# EAGLE design 40Ortho (EAGLE 9.6.2)
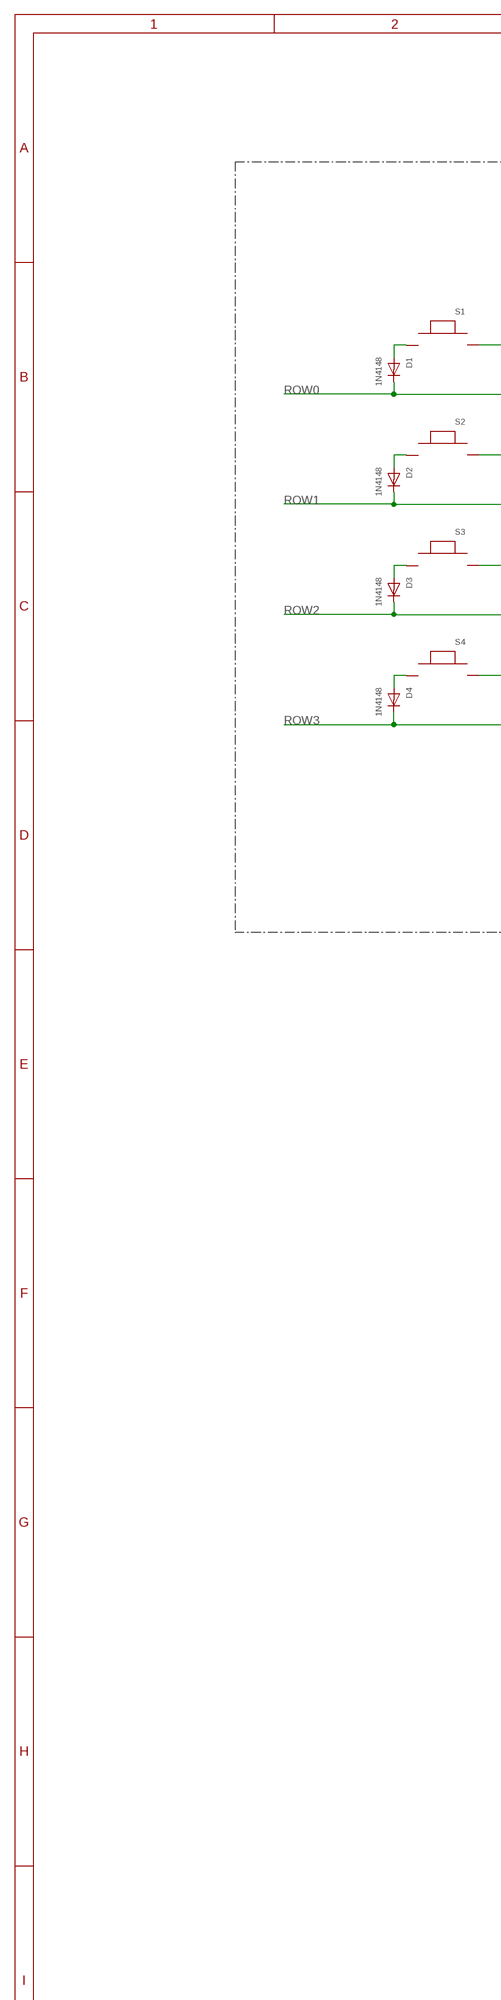
[diagram p0: schematic, sheet 1, part 1 of 2]
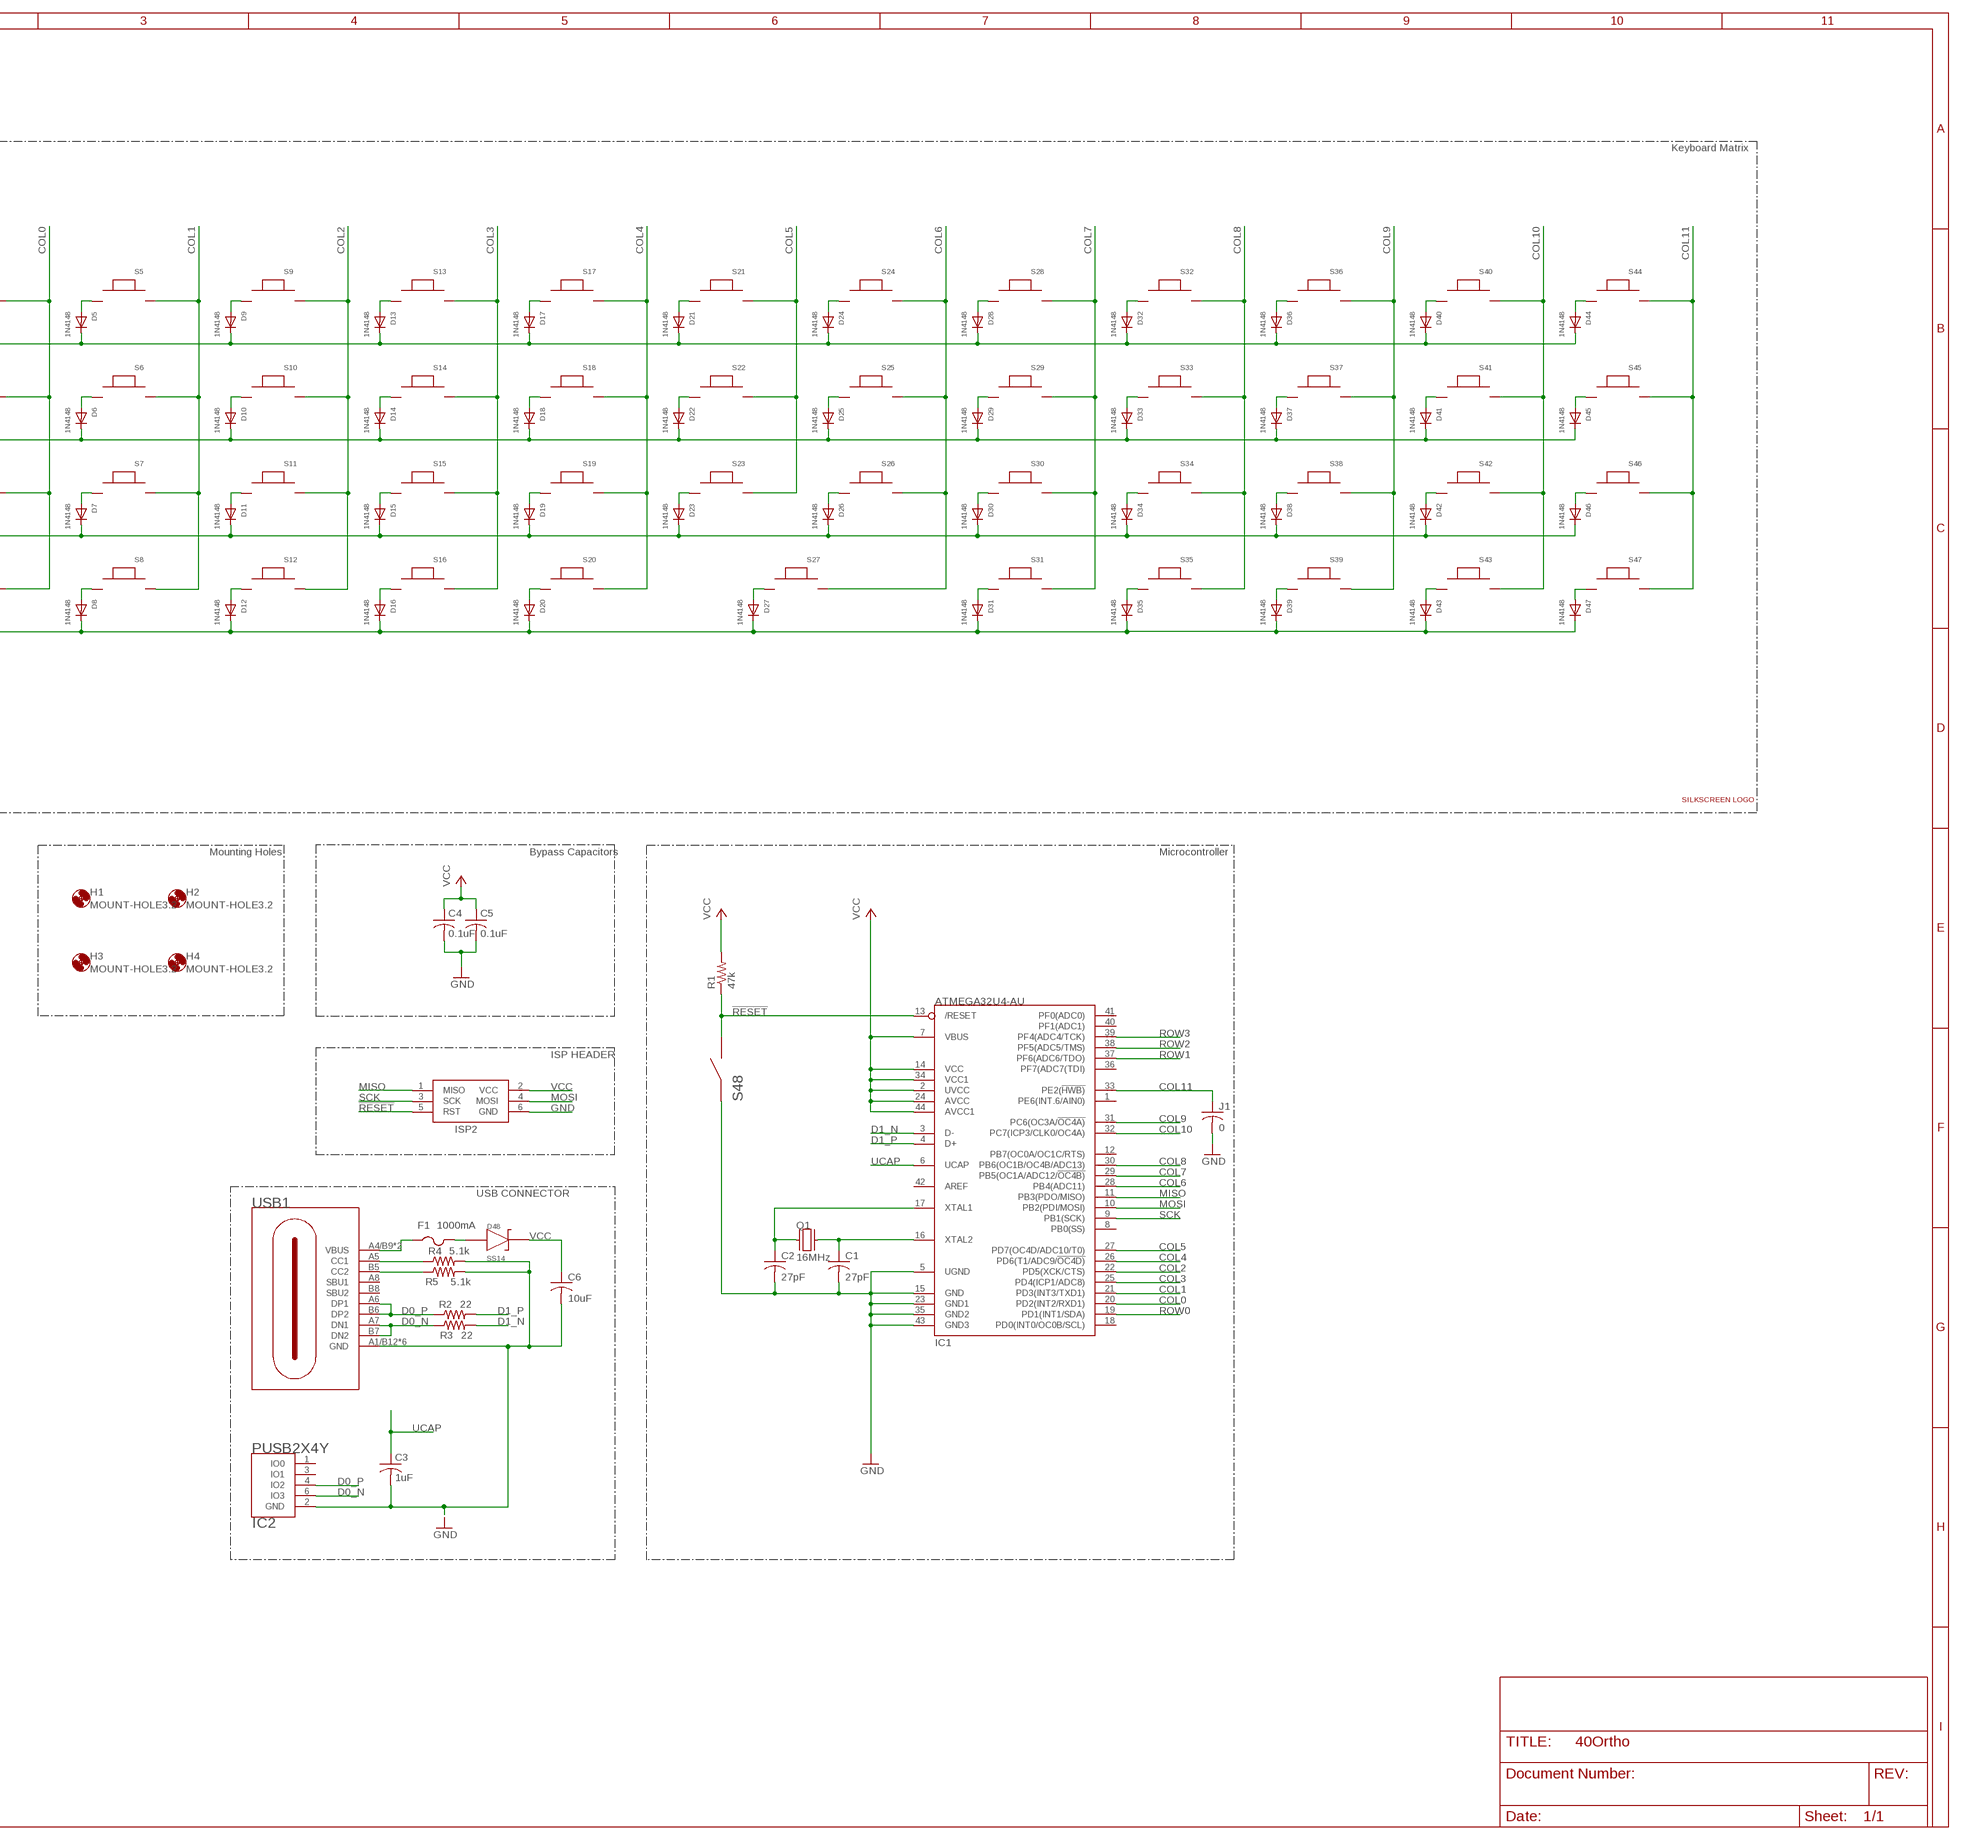
[diagram p1: schematic, sheet 1, part 2 of 2]

## Parts
C1  27pF  C-USC0805  [C0805]
C2  27pF  C-USC0805  [C0805]
C3  1uF  C-USC0805  [C0805]
C4  0.1uF  C-USC0805  [C0805]
C5  0.1uF  C-USC0805  [C0805]
C6  10uF  C-USC0805  [C0805]
D1  1N4148  DIODESOD-323F  [SOD-323F]
D2  1N4148  DIODESOD-323F  [SOD-323F]
D3  1N4148  DIODESOD-323F  [SOD-323F]
D4  1N4148  DIODESOD-323F  [SOD-323F]
D5  1N4148  DIODESOD-323F  [SOD-323F]
D6  1N4148  DIODESOD-323F  [SOD-323F]
D7  1N4148  DIODESOD-323F  [SOD-323F]
D8  1N4148  DIODESOD-323F  [SOD-323F]
D9  1N4148  DIODESOD-323F  [SOD-323F]
D10  1N4148  DIODESOD-323F  [SOD-323F]
D11  1N4148  DIODESOD-323F  [SOD-323F]
D12  1N4148  DIODESOD-323F  [SOD-323F]
D13  1N4148  DIODESOD-323F  [SOD-323F]
D14  1N4148  DIODESOD-323F  [SOD-323F]
D15  1N4148  DIODESOD-323F  [SOD-323F]
D16  1N4148  DIODESOD-323F  [SOD-323F]
D17  1N4148  DIODESOD-323F  [SOD-323F]
D18  1N4148  DIODESOD-323F  [SOD-323F]
D19  1N4148  DIODESOD-323F  [SOD-323F]
D20  1N4148  DIODESOD-323F  [SOD-323F]
D21  1N4148  DIODESOD-323F  [SOD-323F]
D22  1N4148  DIODESOD-323F  [SOD-323F]
D23  1N4148  DIODESOD-323F  [SOD-323F]
D24  1N4148  DIODESOD-323F  [SOD-323F]
D25  1N4148  DIODESOD-323F  [SOD-323F]
D26  1N4148  DIODESOD-323F  [SOD-323F]
D27  1N4148  DIODESOD-323F  [SOD-323F]
D28  1N4148  DIODESOD-323F  [SOD-323F]
D29  1N4148  DIODESOD-323F  [SOD-323F]
D30  1N4148  DIODESOD-323F  [SOD-323F]
D31  1N4148  DIODESOD-323F  [SOD-323F]
D32  1N4148  DIODESOD-323F  [SOD-323F]
D33  1N4148  DIODESOD-323F  [SOD-323F]
D34  1N4148  DIODESOD-323F  [SOD-323F]
D35  1N4148  DIODESOD-323F  [SOD-323F]
D36  1N4148  DIODESOD-323F  [SOD-323F]
D37  1N4148  DIODESOD-323F  [SOD-323F]
D38  1N4148  DIODESOD-323F  [SOD-323F]
D39  1N4148  DIODESOD-323F  [SOD-323F]
D40  1N4148  DIODESOD-323F  [SOD-323F]
D41  1N4148  DIODESOD-323F  [SOD-323F]
D42  1N4148  DIODESOD-323F  [SOD-323F]
D43  1N4148  DIODESOD-323F  [SOD-323F]
D44  1N4148  DIODESOD-323F  [SOD-323F]
D45  1N4148  DIODESOD-323F  [SOD-323F]
D46  1N4148  DIODESOD-323F  [SOD-323F]
D47  1N4148  DIODESOD-323F  [SOD-323F]
D48  SS14  [DO-214AC]
F1  1000mA  PTCFUSE-1206  [R1206]
H1  MOUNT-HOLE3.2  [3,2]
H2  MOUNT-HOLE3.2  [3,2]
H3  MOUNT-HOLE3.2  [3,2]
H4  MOUNT-HOLE3.2  [3,2]
IC1  ATMEGA32U4-AU  [TQFP44]
IC2  PUSB2X4Y  [SOT363]
ISP2  AVRISP-6  [AVRISP]
J1  0  C-USC0805  [C0805]
Q1  16MHz  ABLS7M2  [ABLS7M2]
R1  47k  R-US_R0805  [R0805]
R2  22  R-US_R0805  [R0805]
R3  22  R-US_R0805  [R0805]
R4  5.1k  R-US_R0805  [R0805]
R5  5.1k  R-US_R0805  [R0805]
S1  MX_SMD_1U  [MX_SMD]
S2  MX_SMD_1U  [MX_SMD]
S3  MX_SMD_1U  [MX_SMD]
S4  MX_SMD_1U  [MX_SMD]
S5  MX_SMD_1U  [MX_SMD]
S6  MX_SMD_1U  [MX_SMD]
S7  MX_SMD_1U  [MX_SMD]
S8  MX_SMD_1U  [MX_SMD]
S9  MX_SMD_1U  [MX_SMD]
S10  MX_SMD_1U  [MX_SMD]
S11  MX_SMD_1U  [MX_SMD]
S12  MX_SMD_1U  [MX_SMD]
S13  MX_SMD_1U  [MX_SMD]
S14  MX_SMD_1U  [MX_SMD]
S15  MX_SMD_1U  [MX_SMD]
S16  MX_SMD_1U  [MX_SMD]
S17  MX_SMD_1U  [MX_SMD]
S18  MX_SMD_1U  [MX_SMD]
S19  MX_SMD_1U  [MX_SMD]
S20  MX_SMD_1U  [MX_SMD]
S21  MX_SMD_1U  [MX_SMD]
S22  MX_SMD_1U  [MX_SMD]
S23  MX_SMD_1U  [MX_SMD]
S24  MX_SMD_1U  [MX_SMD]
S25  MX_SMD_1U  [MX_SMD]
S26  MX_SMD_1U  [MX_SMD]
S27  MX_SMD_2UH  [MX_SMD2U]
S28  MX_SMD_1U  [MX_SMD]
S29  MX_SMD_1U  [MX_SMD]
S30  MX_SMD_1U  [MX_SMD]
S31  MX_SMD_1U  [MX_SMD]
S32  MX_SMD_1U  [MX_SMD]
S33  MX_SMD_1U  [MX_SMD]
S34  MX_SMD_1U  [MX_SMD]
S35  MX_SMD_1U  [MX_SMD]
S36  MX_SMD_1U  [MX_SMD]
S37  MX_SMD_1U  [MX_SMD]
S38  MX_SMD_1U  [MX_SMD]
S39  MX_SMD_1U  [MX_SMD]
S40  MX_SMD_1U  [MX_SMD]
S41  MX_SMD_1U  [MX_SMD]
S42  MX_SMD_1U  [MX_SMD]
S43  MX_SMD_1U  [MX_SMD]
S44  MX_SMD_1U  [MX_SMD]
S45  MX_SMD_1U  [MX_SMD]
S46  MX_SMD_1U  [MX_SMD]
S47  MX_SMD_1U  [MX_SMD]
S48  B3U-1000P  [B3U-1000P]
U$1  LOGO  [LOGO]
USB1  USBC_16PINSMD  [USBC_16PINSMD]

## Nets
!RESET: IC1.13(/RESET) ISP2.5(RST) R1.1 S48.2
COL0: IC1.20(PD2(INT2/RXD1)) S1.P$2 S2.P$2 S3.P$2 S4.P$2
COL1: IC1.21(PD3(INT3/TXD1)) S5.P$2 S6.P$2 S7.P$2 S8.P$2
COL2: IC1.22(PD5(XCK/CTS)) S9.P$2 S10.P$2 S11.P$2 S12.P$2
COL3: IC1.25(PD4(ICP1/ADC8)) S13.P$2 S14.P$2 S15.P$2 S16.P$2
COL4: IC1.26(PD6(T1/ADC9/!OC4D)) S17.P$2 S18.P$2 S19.P$2 S20.P$2
COL5: IC1.27(PD7(OC4D/ADC10/T0)) S21.P$2 S22.P$2 S23.P$2
COL6: IC1.28(PB4(ADC11)) S24.P$2 S25.P$2 S26.P$2 S27.P$2
COL7: IC1.29(PB5(OC1A/ADC12/!OC4B)) S28.P$2 S29.P$2 S30.P$2 S31.P$2
COL8: IC1.30(PB6(OC1B/OC4B/ADC13)) S32.P$2 S33.P$2 S34.P$2 S35.P$2
COL9: IC1.31(PC6(OC3A/!OC4A)) S36.P$2 S37.P$2 S38.P$2 S39.P$2
COL10: IC1.32(PC7(ICP3/CLK0/OC4A)) S40.P$2 S41.P$2 S42.P$2 S43.P$2
COL11: IC1.33(PE2(!HWB)) J1.1 S44.P$2 S45.P$2 S46.P$2 S47.P$2
D0_N [differential]: IC2.6(IO3) R3.1 USB1.A7(DN1) USB1.B7(DN2)
D0_P [differential]: IC2.4(IO2) R2.1 USB1.A6(DP1) USB1.B6(DP2)
D1_N [differential]: IC1.3(D-) R3.2
D1_P [differential]: IC1.4(D+) R2.2
GND: C1.2 C2.2 C3.2 C4.2 C5.2 C6.2 IC1.5(UGND) IC1.15(GND) IC1.23(GND1) IC1.35(GND2) IC1.43(GND3) IC2.2(GND) ISP2.6(GND) J1.2 R4.2 R5.2 S48.1 USB1.A1/B12(GND) USB1.B1/A12(GND) USB1.GND@1(GND) USB1.GND@2(GND) USB1.GND@3(GND) USB1.GND@4(GND)
MISO: IC1.11(PB3(PDO/MISO)) ISP2.1(MISO)
MOSI: IC1.10(PB2(PDI/MOSI)) ISP2.4(MOSI)
N$1: D32.A S32.P$1
N$2: D33.A S33.P$1
N$3: D34.A S34.P$1
N$4: D35.A S35.P$1
N$5: D36.A S36.P$1
N$6: D37.A S37.P$1
N$7: D38.A S38.P$1
N$8: D8.A S8.P$1
N$9: D40.A S40.P$1
N$10: D1.A S1.P$1
N$11: D2.A S2.P$1
N$12: D3.A S3.P$1
N$13: D4.A S4.P$1
N$14: D41.A S41.P$1
N$15: D5.A S5.P$1
N$16: D6.A S6.P$1
N$17: D9.A S9.P$1
N$18: D10.A S10.P$1
N$19: D7.A S7.P$1
N$20: D12.A S12.P$1
N$21: D42.A S42.P$1
N$22: D11.A S11.P$1
N$23: F1.1 USB1.A4/B9(VBUS) USB1.B4/A9(VBUS)
N$24: D39.A S39.P$1
N$25: D13.A S13.P$1
N$26: D14.A S14.P$1
N$27: D15.A S15.P$1
N$28: D16.A S16.P$1
N$29: D44.A S44.P$1
N$30: D17.A S17.P$1
N$31: D18.A S18.P$1
N$32: D19.A S19.P$1
N$33: D20.A S20.P$1
N$34: D45.A S45.P$1
N$35: D21.A S21.P$1
N$36: D22.A S22.P$1
N$37: D23.A S23.P$1
N$38: D48.1(ANODE) F1.2
N$39: D46.A S46.P$1
N$40: D24.A S24.P$1
N$41: D25.A S25.P$1
N$42: D26.A S26.P$1
N$44: R4.1 USB1.A5(CC1)
N$45: D28.A S28.P$1
N$46: D29.A S29.P$1
N$47: D30.A S30.P$1
N$48: D31.A S31.P$1
N$49: R5.1 USB1.B5(CC2)
N$52: D27.A S27.P$1
N$54: D43.A S43.P$1
N$56: D47.A S47.P$1
ROW0: D1.C D5.C D9.C D13.C D17.C D21.C D24.C D28.C D32.C D36.C D40.C D44.C IC1.19(PD1(INT1/SDA))
ROW1: D2.C D6.C D10.C D14.C D18.C D22.C D25.C D29.C D33.C D37.C D41.C D45.C IC1.37(PF6(ADC6/TDO))
ROW2: D3.C D7.C D11.C D15.C D19.C D23.C D26.C D30.C D34.C D38.C D42.C D46.C IC1.38(PF5(ADC5/TMS))
ROW3: D4.C D8.C D12.C D16.C D20.C D27.C D31.C D35.C D39.C D43.C D47.C IC1.39(PF4(ADC4/TCK))
SCK: IC1.9(PB1(SCK)) ISP2.3(SCK)
UCAP: C3.1 IC1.6(UCAP)
VCC: C4.1 C5.1 C6.1 D48.2(CATHODE) IC1.2(UVCC) IC1.7(VBUS) IC1.14(VCC) IC1.24(AVCC) IC1.34(VCC1) IC1.44(AVCC1) ISP2.2(VCC) R1.2
XTAL1: C2.1 IC1.17(XTAL1) Q1.X1
XTAL2: C1.1 IC1.16(XTAL2) Q1.X2
Unconnected: IC1.1(PE6(INT.6/AIN0)) IC1.8(PB0(SS)) IC1.12(PB7(OC0A/OC1C/RTS)) IC1.18(PD0(INT0/OC0B/SCL)) IC1.36(PF7(ADC7(TDI)) IC1.40(PF1(ADC1)) IC1.41(PF0(ADC0)) IC1.42(AREF) IC2.1(IO0) IC2.3(IO1) USB1.A8(SBU1) USB1.B8(SBU2)

## Notes on the sheet
- Keyboard Matrix
- Mounting Holes | Bypass Capacitors | Microcontroller
- ISP HEADER
- USB CONNECTOR

## Library data of the parts
C1-C6 J1 = rcl:C-US: CAPACITOR, American symbol; SPICEPREFIX: C
D1 D6 = adafruit:DIODE: Diode SMADIODE - SMA Surface Mount Package 20V 1A Schottky Diode Digikey: 641-1014-6-ND DO-1N4148 - Through Hole Small Current Diode SOD-123 20V 1 A (.5mV Vf) Schottky Diode - Digikey: MBRX120TPMSCT-ND SOD-323 10V 570mA (.38mV Vf, 3ns) Schottky Diode - Digikey: ZLLS410CT-ND SOD-523 30V 30mA Schottky Diode (RB751S-40TE61) - Digikey: RB751S-40TE61CT-ND SOT23-R/W - SOT23 Package (R = Solder Paste/Reflow Ovens, W = Hand-Soldering) BAT54Film 40V 300mA - Digikey: 497-7162-1-ND; SPICEPREFIX: D
D2-D5 D7-D47 = adafruit:DIODE: Diode SMADIODE - SMA Surface Mount Package 20V 1A Schottky Diode Digikey: 641-1014-6-ND DO-1N4148 - Through Hole Small Current Diode SOD-123 20V 1 A (.5mV Vf) Schottky Diode - Digikey: MBRX120TPMSCT-ND SOD-323 10V 570mA (.38mV Vf, 3ns) Schottky Diode - Digikey: ZLLS410CT-ND SOD-523 30V 30mA Schottky Diode (RB751S-40TE61) - Digikey: RB751S-40TE61CT-ND SOT23-R/W - SOT23 Package (R = Solder Paste/Reflow Ovens, W = Hand-Soldering) BAT54Film 40V 300mA - Digikey: 497-7162-1-ND
D48 = diode - ON Semiconductor:SS14
F1 = adafruit:PTCFUSE: PTC fuses, resettable thermistors
H1-H4 = holes:MOUNT-HOLE: MOUNTING HOLE with drill center marker
IC1 = adafruit:ATMEGA32U4: http://www.ladyada.net/library/eagle
IC2 = ESD Protection:PUSB2X4Y
ISP2 = adafruit:AVRISP: AVR ISP HEADER Standard 6 pin header for AVR programming
Q1 = Crystal_SMD:ABLS7M2: Digikey Part Number: 535-12830-1-ND
R1-R5 = rcl:R-US_: RESISTOR, American symbol; SPICEPREFIX: R
S1-S26 S28-S47 = MX_Switch:MX_SMD_1U: Cherry MX Switch (1 Unit) Package: Cherry MX Description: Outline for 1x Cherry MX style switch. Includes holes for PCB mounted switches. No Diode or LED. Author: Luke LaCasse Date Created/(Modified): 6/30/20 (6/30/20)
S27 = MX_Switch:MX_SMD_2UH: Cherry MX Switch Horizontal (2 Unit) Package: Cherry MX Description: Symbol and Footprint for 1x Cherry MX style switch with spacing for a 2U Horizontal keycap. Includes holes for PCB mounted switches. No Diode or LED. Author: Luke LaCasse Date Created/(Modified): 6/30/20 (6/30/20)
S48 = omron-switch:B3U-1000P
U$1 = Logo 2020:LOGO
USB1 = USB-C:USBC_16PINSMD

## Net classes
1 differential: width 0.152 mm

## Board
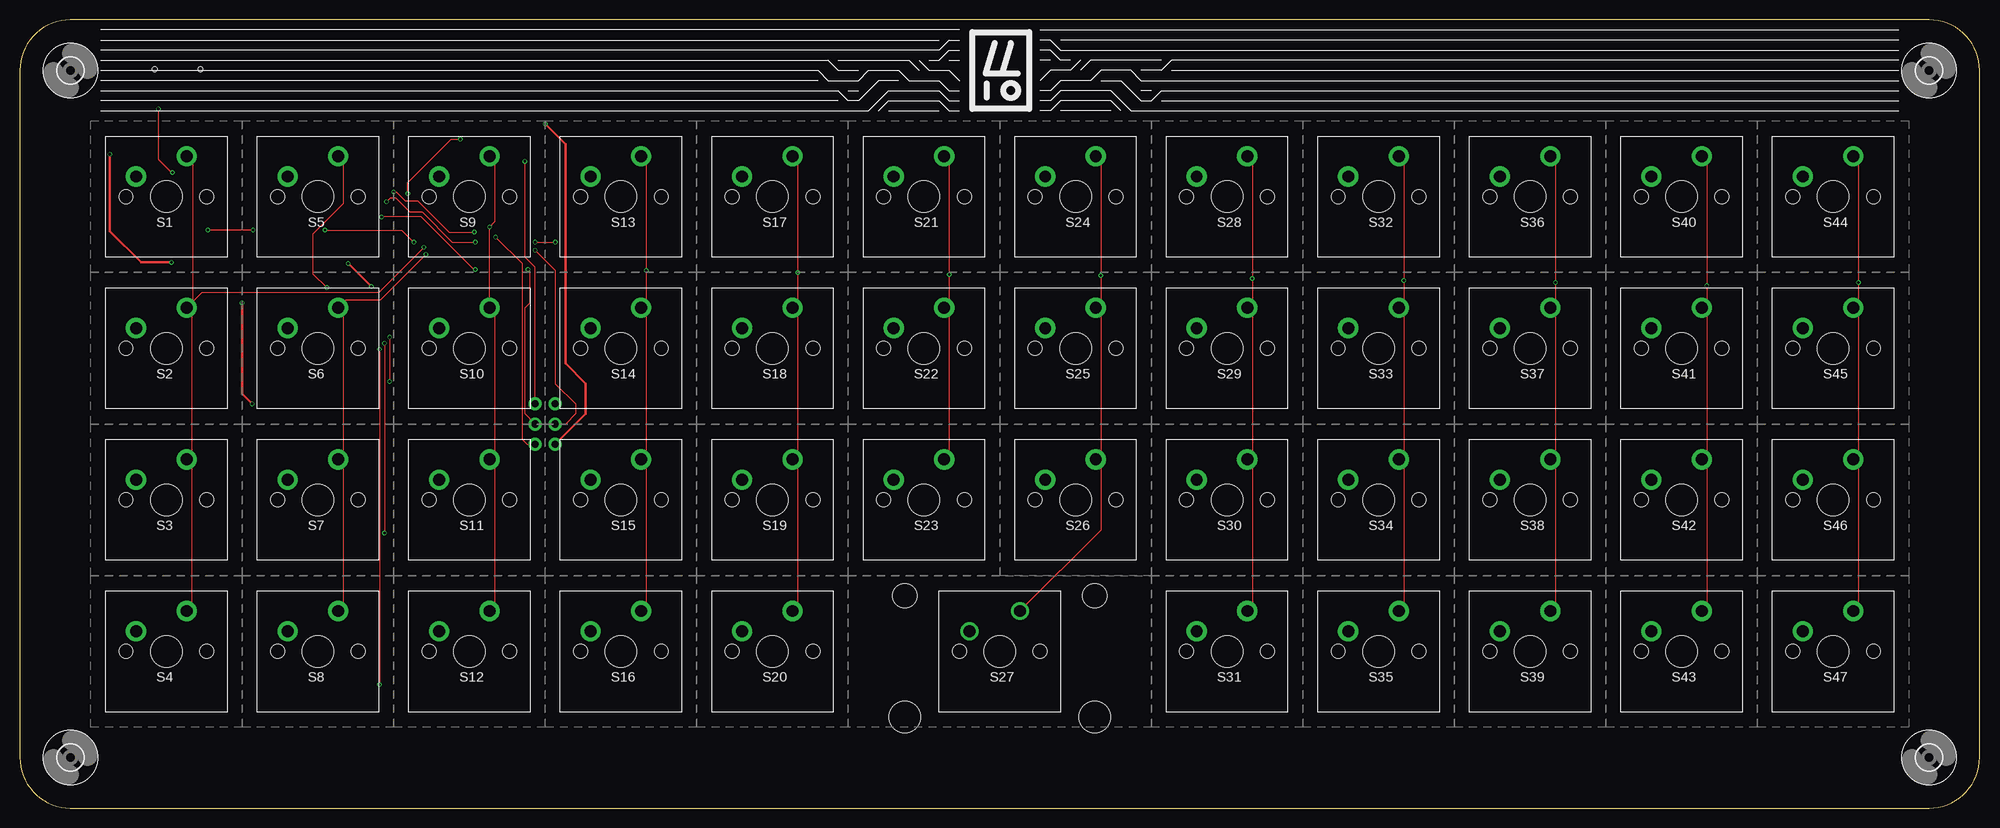
[diagram p2: board, top side]
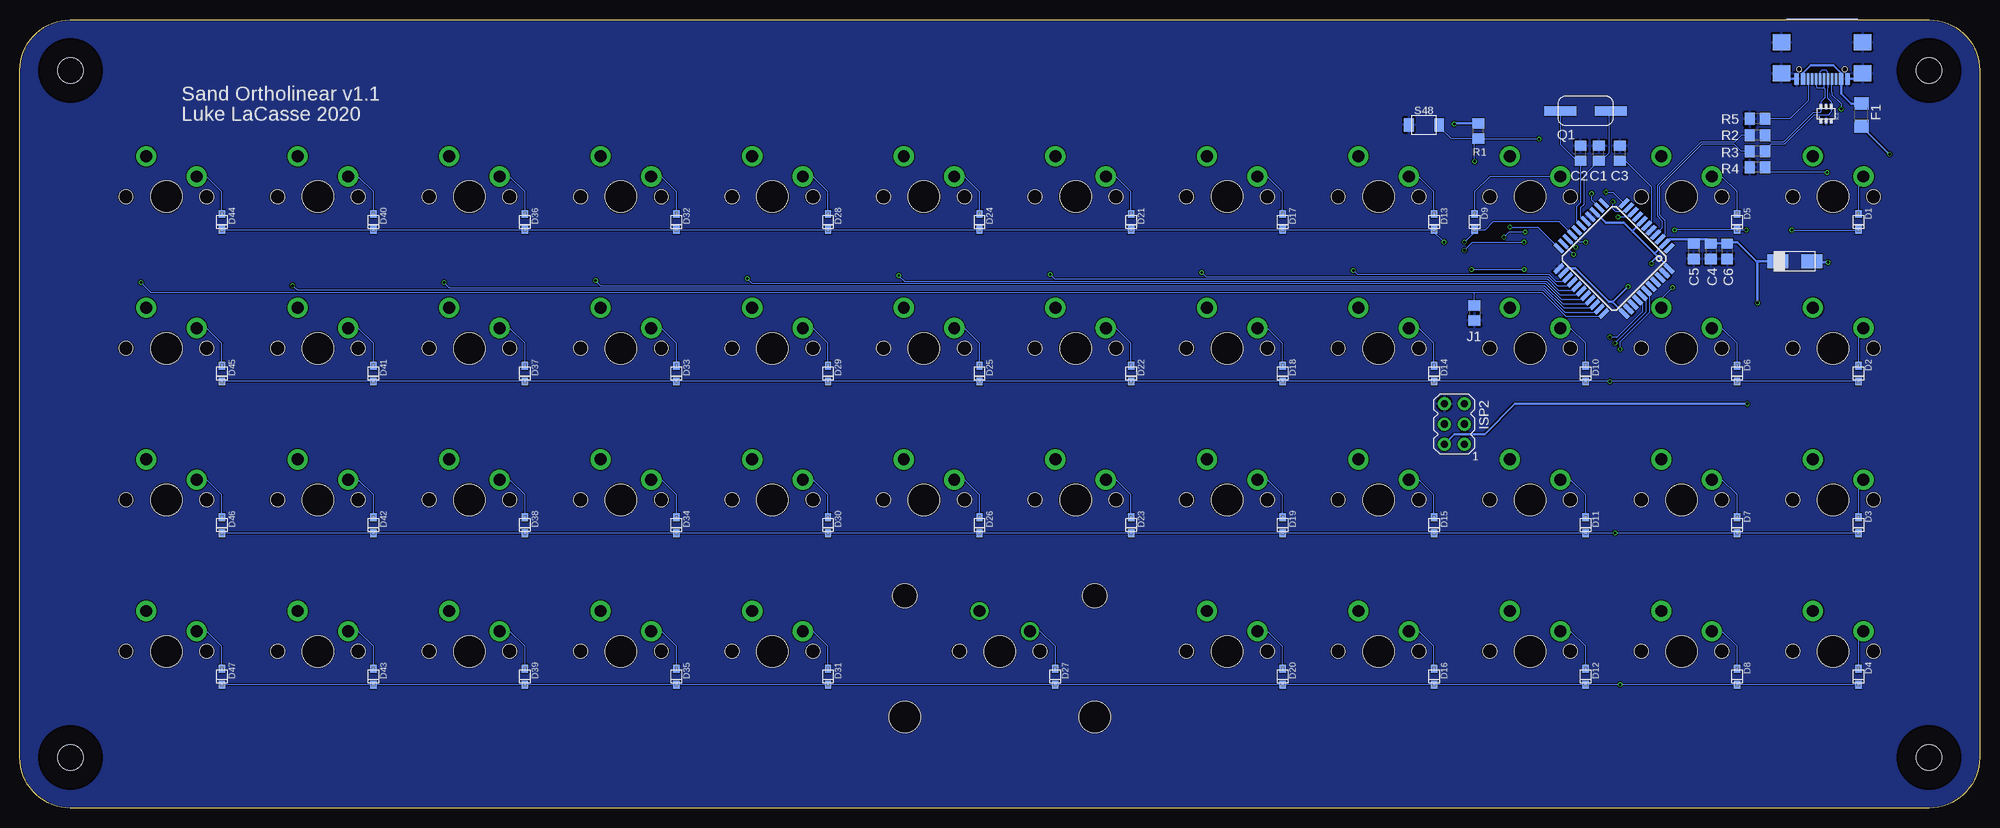
[diagram p3: board, bottom side, seen from below]

Size 246.38 x 99.06 mm. Coordinates in mm from the lower left corner, seen from the top.
Outline: 6.35,0 240.03,0 arc90 246.38,6.35 246.38,92.71 arc90 240.03,99.06 6.35,99.06 arc90 0,92.71 0,6.35 arc90 6.35,0
Copper layers (1*16): Top 0.035mm / dielectric 1.53mm / Bottom 0.035mm
Design rules "JLC2LAYERDRC": minimum track width 5mil, minimum drill 0.2mm, track to track 5mil, track to pad 5mil, pad to pad 5mil, via to via 10mil, smd to smd 0mil, copper to edge 5mil, drill to drill 0.54mm, minimum pad ring 4mil, minimum via ring 4mil, stop-mask expansion 3mil, vias tented up to drill 100mil, thermal gap 10mil

### Footprints (pad centres in the part's own frame; a part is rotated, then mirrored left to right if it is on the bottom)
C0805 = smd 1.3 x 1.5: 1 -0.95,0; 2 0.95,0
SOD-323F = smd 1 x 0.8: A -1,0; C 1,0
DO-214AC = smd 2.65 x 1.75: 1 -2.15,0; 2 2.15,0
R1206 = smd 1.6 x 1.803: 1 -1.422,0; 2 1.422,0
3,2 = hole 3.2: 0,0
TQFP44 = smd 1.5 x 0.5: 1 -5.8,4; 2 -5.8,3.2; 3 -5.8,2.4; 4 -5.8,1.6; 5 -5.8,0.8; 6 -5.8,0; 7 -5.8,-0.8; 8 -5.8,-1.6; 9 -5.8,-2.4; 10 -5.8,-3.2; 11 -5.8,-4; 23 5.8,-4; 24 5.8,-3.2; 25 5.8,-2.4; 26 5.8,-1.6; 27 5.8,-0.8; 28 5.8,0; 29 5.8,0.8; 30 5.8,1.6; 31 5.8,2.4; 32 5.8,3.2; 33 5.8,4 | smd 0.5 x 1.5: 12 -4,-5.8; 13 -3.2,-5.8; 14 -2.4,-5.8; 15 -1.6,-5.8; 16 -0.8,-5.8; 17 0,-5.8; 18 0.8,-5.8; 19 1.6,-5.8; 20 2.4,-5.8; 21 3.2,-5.8; 22 4,-5.8; 34 4,5.8; 35 3.2,5.8; 36 2.4,5.8; 37 1.6,5.8; 38 0.8,5.8; 39 0,5.8; 40 -0.8,5.8; 41 -1.6,5.8; 42 -2.4,5.8; 43 -3.2,5.8; 44 -4,5.8
SOT363 = smd 0.7 x 0.35: 1 -0.9,0.65; 2 -0.9,0; 3 -0.9,-0.65; 4 0.9,0.65; 5 0.9,0; 6 0.9,-0.65
AVRISP = drill 0.9 pad 1.626: 1 -1.27,2.54; 2 1.27,2.54; 3 -1.27,0; 4 1.27,0; 5 -1.27,-2.54; 6 1.27,-2.54
ABLS7M2 = smd 4 x 1.2: X1 -3.175,0; X2 3.175,0
R0805 = smd 1.3 x 1.5: 1 -0.95,0; 2 0.95,0
MX_SMD = drill 1.499 pad 2.54: P$1 -3.81,2.54; P$2 2.54,5.08 | hole 3.988: 0,0 | hole 1.778: -5.08,0; 5.08,0
MX_SMD2U = drill 1.499: P$1 -3.81,2.54; P$2 2.54,5.08 | hole 3.988: 0,0; -11.938,-8.255; 11.938,-8.255 | hole 1.778: -5.08,0; 5.08,0 | hole 3.048: -11.938,6.985; 11.938,6.985
B3U-1000P = smd 1.2 x 1.7: 1 -1.9,0; 2 1.9,0
USBC_16PINSMD = smd 0.6 x 1.4: A1/B12 -3.2,4.632; A4/B9 -2.4,4.632; B1/A12 3.2,4.632; B4/A9 2.4,4.632 | smd 0.3 x 1.4: A5 -1.25,4.632; A6 -0.25,4.632; A7 0.25,4.632; A8 1.25,4.632; B5 1.75,4.632; B6 0.75,4.632; B7 -0.75,4.632; B8 -1.75,4.632 | smd 2.18 x 2: GND@1 -5.11,0; GND@2 5.11,0; GND@3 -5.11,3.93; GND@4 5.11,3.93 | hole 0.65: -2.89,3.43; 2.89,3.43

### Placement (x,y rotation side)
C1  47.88,82.3 90 bottom
C2  50.16,82.3 90 bottom
C3  45.21,82.3 90 bottom
C4  33.78,69.98 270 bottom
C5  35.94,69.98 270 bottom
C6  31.75,69.98 270 bottom
D1  15.24,73.66 270 bottom
D2  15.24,54.61 270 bottom
D3  15.24,35.56 270 bottom
D4  15.24,16.51 270 bottom
D5  30.48,73.66 270 bottom
D6  30.48,54.61 270 bottom
D7  30.48,35.56 270 bottom
D8  30.48,16.51 270 bottom
D9  63.5,73.66 270 bottom
D10  49.53,54.61 270 bottom
D11  49.53,35.56 270 bottom
D12  49.53,16.51 270 bottom
D13  68.58,73.66 270 bottom
D14  68.58,54.61 270 bottom
D15  68.58,35.56 270 bottom
D16  68.58,16.51 270 bottom
D17  87.63,73.66 270 bottom
D18  87.63,54.61 270 bottom
D19  87.63,35.56 270 bottom
D20  87.63,16.51 270 bottom
D21  106.68,73.66 270 bottom
D22  106.68,54.61 270 bottom
D23  106.68,35.56 270 bottom
D24  125.73,73.66 270 bottom
D25  125.73,54.61 270 bottom
D26  125.73,35.56 270 bottom
D27  116.2,16.51 270 bottom
D28  144.78,73.66 270 bottom
D29  144.78,54.61 270 bottom
D30  144.78,35.56 270 bottom
D31  144.78,16.51 270 bottom
D32  163.83,73.66 270 bottom
D33  163.83,54.61 270 bottom
D34  163.83,35.56 270 bottom
D35  163.83,16.51 270 bottom
D36  182.88,73.66 270 bottom
D37  182.88,54.61 270 bottom
D38  182.88,35.56 270 bottom
D39  182.88,16.51 270 bottom
D40  201.93,73.66 270 bottom
D41  201.93,54.61 270 bottom
D42  201.93,35.56 270 bottom
D43  201.93,16.51 270 bottom
D44  220.98,73.66 270 bottom
D45  220.98,54.61 270 bottom
D46  220.98,35.56 270 bottom
D47  220.98,16.51 270 bottom
D48  23.24,68.71 180 bottom
F1  14.86,87.12 270 bottom
H1  6.35,6.35 0 top
H2  6.35,92.71 0 top
H3  240.03,92.71 0 top
H4  240.03,6.35 0 top
IC1  45.97,69.09 225 bottom
IC2  19.3,87.25 90 bottom
ISP2  66.04,48.26 180 bottom
J1  63.5,62.23 270 bottom
Q1  49.53,87.63 0 bottom
R1  62.99,85.09 90 bottom
R2  27.94,84.58 180 bottom
R3  27.94,82.55 180 bottom
R4  27.94,80.52 180 bottom
R5  27.94,86.61 180 bottom
S1  18.41,76.83 0 top
S2  18.41,57.78 0 top
S3  18.41,38.73 0 top
S4  18.41,19.68 0 top
S5  37.47,76.83 0 top
S6  37.47,57.78 0 top
S7  37.47,38.73 0 top
S8  37.47,19.68 0 top
S9  56.52,76.83 0 top
S10  56.52,57.78 0 top
S11  56.52,38.73 0 top
S12  56.52,19.68 0 top
S13  75.56,76.83 0 top
S14  75.56,57.78 0 top
S15  75.56,38.73 0 top
S16  75.56,19.68 0 top
S17  94.61,76.83 0 top
S18  94.61,57.78 0 top
S19  94.61,38.73 0 top
S20  94.61,19.68 0 top
S21  113.67,76.83 0 top
S22  113.67,57.78 0 top
S23  113.67,38.73 0 top
S24  132.72,76.83 0 top
S25  132.72,57.78 0 top
S26  132.72,38.73 0 top
S27  123.19,19.68 0 top
S28  151.76,76.83 0 top
S29  151.76,57.78 0 top
S30  151.76,38.73 0 top
S31  151.76,19.68 0 top
S32  170.81,76.83 0 top
S33  170.81,57.78 0 top
S34  170.81,38.73 0 top
S35  170.81,19.68 0 top
S36  189.87,76.83 0 top
S37  189.87,57.78 0 top
S38  189.87,38.73 0 top
S39  189.87,19.68 0 top
S40  208.91,76.83 0 top
S41  208.91,57.78 0 top
S42  208.91,38.73 0 top
S43  208.91,19.68 0 top
S44  227.97,76.83 0 top
S45  227.97,57.78 0 top
S46  227.97,38.73 0 top
S47  227.97,19.68 0 top
S48  69.85,85.85 0 bottom
U$1  123.32,92.71 0 top
USB1  19.81,96.27 180 bottom

### Tracks (layer width: path | path; a pad name or v marks a point on that pad's centre or on a via)
!RESET  (via drill 0.35)
  Top 0.152: v48.77,77.22 48.77,78.61 54.23,84.07 v55.37,84.07 | ISP2.5 64.77,67.94 63.5,69.22 v63.5,81.28
  Bottom 0.152: R1.1 66.44,84.14 67.95,85.65 S48.2 | IC1.13 48.77,76.41 v48.77,77.22 | v55.37,84.07 62.93,84.07 R1.1 | v63.5,81.28 63.5,83.63 R1.1
COL0  (via drill 0.35)
  Top 0.152: S4.P$2 21.59,25.4 21.59,43.18 S3.P$2 21.59,44.45 21.59,62.23 S2.P$2 | S1.P$2 21.72,81.15 21.72,63.63 S2.P$2 | v50.8,70.48 45.09,64.77 22.86,64.77 S2.P$2
  Bottom 0.152: IC1.20 50.8,70.52 v50.8,70.48
COL1  (via drill 0.35)
  Top 0.152: S8.P$2 40.64,25.4 40.64,43.18 S7.P$2 40.64,44.45 40.64,62.23 S6.P$2 41,63.86 45.33,63.86 51.05,69.58 v51.05,69.6 | S5.P$2 40.64,81.28 40.64,75.95 36.83,72.14 36.83,67.18 v38.61,65.41
  Bottom 0.152: v38.61,65.41 40.01,64.01 S6.P$2 | v51.05,69.6 52.34,70.88 IC1.21
COL2  (via drill 0.35)
  Top 0.152: S12.P$2 59.69,25.4 59.69,43.18 S11.P$2 59.69,44.45 59.69,62.23 S10.P$2 v59.05,73.03 59.69,73.66 59.69,81.28 S9.P$2
  Bottom 0.152: IC1.22 55.57,73.03 v59.05,73.03
COL3  (via drill 0.35)
  Top 0.152: S13.P$2 78.74,81.28 v78.74,67.56 78.74,63.5 S14.P$2 78.74,62.23 78.74,44.45 S15.P$2 78.74,43.18 78.74,25.4 S16.P$2
  Bottom 0.152: IC1.25 52.29,66.17 53.23,66.17 54.06,67 78.18,67 v78.74,67.56
COL4  (via drill 0.35)
  Top 0.152: S20.P$2 97.79,25.4 97.79,43.18 S19.P$2 97.79,44.45 97.79,62.23 S18.P$2 97.79,63.5 v97.79,67.31 97.79,81.28 S17.P$2
  Bottom 0.152: IC1.26 51.74,65.58 53.04,65.58 54.18,66.73 97.21,66.73 v97.79,67.31
COL5  (via drill 0.35)
  Top 0.152: S21.P$2 116.84,81.28 v116.84,67.06 116.84,63.5 S22.P$2 116.84,62.23 116.84,44.45 S23.P$2
  Bottom 0.152: IC1.27 51.17,65.02 52.87,65.02 54.3,66.45 116.23,66.45 v116.84,67.06
COL6  (via drill 0.35)
  Top 0.152: S27.P$2 135.89,34.92 135.89,43.18 S26.P$2 135.89,44.45 135.89,62.36 135.38,62.87 S25.P$2 135.89,63.5 v135.89,66.93 135.89,81.28 S24.P$2
  Bottom 0.152: IC1.28 50.62,64.44 52.69,64.44 54.41,66.17 135.13,66.17 v135.89,66.93
COL7  (via drill 0.35)
  Top 0.152: S31.P$2 154.94,25.4 154.94,43.18 S30.P$2 154.94,44.45 154.94,62.23 S29.P$2 154.94,63.5 v154.94,66.55 154.94,81.28 S28.P$2
  Bottom 0.152: IC1.29 50.02,63.91 52.55,63.91 54.53,65.89 154.28,65.89 v154.94,66.55
COL8  (via drill 0.35)
  Top 0.152: S35.P$2 173.99,25.4 173.99,43.18 S34.P$2 173.99,44.45 173.99,62.23 S33.P$2 173.99,63.5 v173.99,66.29 173.99,81.28 S32.P$2
  Bottom 0.152: IC1.30 49.48,63.32 52.36,63.32 54.64,65.61 173.3,65.61 v173.99,66.29
COL9  (via drill 0.35)
  Top 0.152: S39.P$2 193.04,25.4 193.04,43.18 S38.P$2 193.04,44.45 193.04,62.23 S37.P$2 193.04,63.5 v193.04,66.04 193.04,81.28 S36.P$2
  Bottom 0.152: IC1.31 48.88,62.79 52.22,62.79 54.76,65.33 192.33,65.33 v193.04,66.04
COL10  (via drill 0.35)
  Top 0.152: S43.P$2 212.09,25.4 212.09,43.18 S42.P$2 212.09,44.45 212.09,62.23 S41.P$2 212.09,63.5 v212.09,65.66 212.09,81.28 S40.P$2
  Bottom 0.152: IC1.32 48.28,62.26 52.08,62.26 54.88,65.05 211.48,65.05 v212.09,65.66
COL11  (via drill 0.35)
  Top 0.152: S47.P$2 231.14,25.4 231.14,43.18 S46.P$2 231.14,44.45 231.14,62.23 S45.P$2 231.14,63.5 v231.14,66.04 231.14,81.28 S44.P$2
  Bottom 0.152: IC1.33 47.68,61.72 51.94,61.72 54.99,64.77 63.5,64.77 | v231.14,66.04 229.87,64.77 63.5,64.77 | J1.1 63.5,64.77
D0_N
  Bottom 0.152: USB1.A7 20.06,92.46 19.81,92.71 19.3,92.71 19.06,92.47 USB1.B7 19.06,90.5 19.17,90.39 19.17,89.28 18.65,88.76 IC2.6 18.65,87.49 19.05,87.1 20.85,87.1 24.54,83.41 26.23,83.41 26.99,82.65 R3.1
D0_P
  Bottom 0.152: USB1.A6 19.56,90.5 | 19.56,90.5 19.45,90.39 19.45,89.28 19.95,88.78 IC2.4 19.95,87.49 20.07,87.38 20.97,87.38 24.65,83.69 26.2,83.69 26.99,84.48 R2.1 | 19.56,90.5 20.4,90.5 20.56,90.67 USB1.B6
D1_N
  Bottom 0.152: R3.2 29.95,82.55 30.82,83.43 34.94,83.43 40.26,78.11 40.26,74.55 39.57,73.86 39.57,72.1 IC1.3
D1_P
  Bottom 0.152: R2.2 29.95,84.58 30.82,83.71 35.05,83.71 40.54,78.22 40.54,74.43 39.95,73.84 39.95,72.85 IC1.4
GND
  Bottom 0.305: USB1.GND@3 15.4,91.63 USB1.A1/B12 | USB1.GND@4 24.22,91.63 USB1.B1/A12
  pour Bottom: -1.27,100.33 247.65,100.33 247.65,-1.27 -1.27,-1.27
MISO  (via drill 0.35)
  Top 0.152: v46.99,77.42 47.37,77.42 48.51,76.27 50.09,76.27 53.98,72.39 v57.15,72.39 | v59.82,71.75 63.12,68.45 63.12,46.35 63.75,45.72 ISP2.1
  Bottom 0.152: v46.99,77.42 46.1,77.42 IC1.11 | v57.15,72.39 59.18,72.39 v59.82,71.75
MOSI  (via drill 0.35)
  Top 0.152: v46.1,76.2 46.61,76.71 47.24,76.71 49.02,74.93 50.55,74.93 54.36,71.12 v57.28,71.12 | v64.77,70.1 67.31,67.56 67.31,53.34 69.85,50.8 69.85,49.53 68.58,48.26 ISP2.4
  Bottom 0.152: IC1.10 44.66,74.93 45.72,74.93 46.1,75.31 v46.1,76.2 | v64.77,70.1 63.75,71.12 v57.28,71.12
N$1
  Bottom 0.152: D32.A 163.83,77.47 165.74,79.38 S32.P$1
N$2
  Bottom 0.152: D33.A 163.83,58.42 165.74,60.33 S33.P$1
N$3
  Bottom 0.152: D34.A 163.83,39.37 165.74,41.27 S34.P$1
N$4
  Bottom 0.152: D35.A 163.83,20.32 165.74,22.23 S35.P$1
N$5
  Bottom 0.152: D36.A 182.88,77.47 184.78,79.38 S36.P$1
N$6
  Bottom 0.152: D37.A 182.88,58.42 184.78,60.33 S37.P$1
N$7
  Bottom 0.152: D38.A 182.88,39.37 184.78,41.27 S38.P$1
N$8
  Bottom 0.152: D8.A 30.48,20.32 32.38,22.23 S8.P$1
N$9
  Bottom 0.152: D40.A 201.93,77.47 203.84,79.38 S40.P$1
N$10
  Bottom 0.152: S1.P$1 15.24,78.74 D1.A
N$11
  Bottom 0.152: S2.P$1 15.24,59.69 D2.A
N$12
  Bottom 0.152: S3.P$1 15.24,40.64 D3.A
N$13
  Bottom 0.152: S4.P$1 15.24,21.59 D4.A
N$14
  Bottom 0.152: D41.A 201.93,58.42 203.84,60.33 S41.P$1
N$15
  Bottom 0.152: D5.A 30.48,77.47 32.38,79.38 S5.P$1
N$16
  Bottom 0.152: D6.A 30.48,58.42 32.38,60.33 S6.P$1
N$17
  Bottom 0.152: S9.P$1 61.59,79.38 63.5,77.47 D9.A
N$18
  Bottom 0.152: D10.A 49.53,58.42 51.44,60.33 S10.P$1
N$19
  Bottom 0.152: D7.A 30.48,39.37 32.38,41.27 S7.P$1
N$20
  Bottom 0.152: D12.A 49.53,20.32 51.44,22.23 S12.P$1
N$21
  Bottom 0.152: D42.A 201.93,39.37 203.84,41.27 S42.P$1
N$22
  Bottom 0.152: D11.A 49.53,39.37 51.44,41.27 S11.P$1
N$23
  Bottom 0.305: F1.1 16.15,88.54 17.41,89.8 USB1.A4/B9 17.41,92.34 18.41,93.34 21.21,93.34 22.21,92.34 USB1.B4/A9
N$24
  Bottom 0.152: D39.A 182.88,20.32 184.78,22.23 S39.P$1
N$25
  Bottom 0.152: D13.A 68.58,77.47 70.48,79.38 S13.P$1
N$26
  Bottom 0.152: D14.A 68.58,58.42 70.48,60.33 S14.P$1
N$27
  Bottom 0.152: D15.A 68.58,39.37 70.48,41.27 S15.P$1
N$28
  Bottom 0.152: D16.A 68.58,20.32 70.48,22.23 S16.P$1
N$29
  Bottom 0.152: D44.A 220.98,77.47 222.88,79.38 S44.P$1
N$30
  Bottom 0.152: D17.A 87.63,77.47 89.53,79.38 S17.P$1
N$31
  Bottom 0.152: D18.A 87.63,58.42 89.53,60.33 S18.P$1
N$32
  Bottom 0.152: D19.A 87.63,39.37 89.53,41.27 S19.P$1
N$33
  Bottom 0.152: D20.A 87.63,20.32 89.53,22.23 S20.P$1
N$34
  Bottom 0.152: D45.A 220.98,58.42 222.88,60.33 S45.P$1
N$35
  Bottom 0.152: D21.A 106.68,77.47 108.58,79.38 S21.P$1
N$36
  Bottom 0.152: D22.A 106.68,58.42 108.58,60.33 S22.P$1
N$37
  Bottom 0.152: D23.A 106.68,39.37 108.58,41.27 S23.P$1
N$38  (via drill 0.35)
  Top 0.305: v11.3,82.17 11.3,72.52 15.24,68.58 v19.05,68.58
  Bottom 0.305: F1.2 11.33,82.17 v11.3,82.17 | v19.05,68.58 20.96,68.58 D48.1
N$39
  Bottom 0.152: D46.A 220.98,39.37 222.88,41.27 S46.P$1
N$40
  Bottom 0.152: D24.A 125.73,77.47 127.64,79.38 S24.P$1
N$41
  Bottom 0.152: D25.A 125.73,58.42 127.64,60.33 S25.P$1
N$42
  Bottom 0.152: D26.A 125.73,39.37 127.64,41.27 S26.P$1
N$44  (via drill 0.35)
  Top 0.152: v17.4,87.88 17.4,81.53 19.05,79.88 v19.18,79.88
  Bottom 0.152: USB1.A5 18.56,90.17 18.56,89.94 18.56,89.68 17.4,88.52 v17.4,87.88 | v19.18,79.88 26.36,79.88 R4.1
N$45
  Bottom 0.152: D28.A 144.78,77.47 146.69,79.38 S28.P$1
N$46
  Bottom 0.152: D29.A 144.78,58.42 146.69,60.33 S29.P$1
N$47
  Bottom 0.152: D30.A 144.78,39.37 146.69,41.27 S30.P$1
N$48
  Bottom 0.152: D31.A 144.78,20.32 146.69,22.23 S31.P$1
N$49
  Bottom 0.152: USB1.B5 21.56,88.93 23.88,86.61 R5.1
N$52
  Bottom 0.152: D27.A 116.2,20.32 118.11,22.23 S27.P$1
N$54
  Bottom 0.152: D43.A 201.93,20.32 203.84,22.23 S43.P$1
N$56
  Bottom 0.152: D47.A 220.98,20.32 222.88,22.23 S47.P$1
ROW0  (via drill 0.35)
  Top 0.152: v29.34,72.64 v23.62,72.64 | v38.35,72.64 48.01,72.64 v49.53,71.12 | v64.77,71.12 v67.31,71.12
  Bottom 0.152: D44.C D40.C D36.C D32.C D28.C D24.C D21.C D17.C D13.C 68.58,72.39 v67.31,71.12 | v38.35,72.64 38.34,72.66 D5.C 29.35,72.66 v29.34,72.64 | v23.62,72.64 15.26,72.64 D1.C | v49.53,71.12 50.27,71.12 IC1.19 52.81,73.66 61.21,73.66 62.23,72.64 63.48,72.64 D9.C 63.5,72.39 v64.77,71.12
ROW1  (via drill 0.35)
  Top 0.152: v46.48,59.18 v46.48,53.61
  Bottom 0.152: D2.C D6.C v46.48,53.61 D10.C D14.C D18.C D22.C D25.C D29.C D33.C D37.C D41.C D45.C | v46.48,59.18 45.59,59.18 42.42,62.36 42.42,63.27 IC1.37
ROW2  (via drill 0.35)
  Top 0.152: v45.85,58.42 v45.85,34.56
  Bottom 0.152: D3.C D7.C v45.85,34.56 D11.C D15.C D19.C D23.C D26.C D30.C D34.C D38.C D42.C D46.C | IC1.38 41.97,63.95 41.97,62.3 v45.85,58.42
ROW3  (via drill 0.35)
  Top 0.152: v45.21,57.66 v45.21,15.51
  Bottom 0.152: D4.C D8.C v45.21,15.51 D12.C D16.C D20.C D27.C D31.C D35.C D39.C D43.C D47.C | IC1.39 41.53,64.64 41.53,62.23 45.21,58.55 v45.21,57.66
SCK  (via drill 0.35)
  Top 0.152: ISP2.3 63.5,49.53 63.5,62.87 64.14,63.5 64.14,67.44 v63.88,67.69 | v57.28,67.69 57.02,67.69 50.42,74.3 v45.47,74.3
  Bottom 0.152: v63.88,67.69 v57.28,67.69 | v45.47,74.3 44.16,74.3 IC1.9
UCAP
  Bottom 0.152: C3.1 44.52,81.35 41.27,78.11 41.27,73.79 IC1.6
VCC  (via drill 0.35)
  Top 0.305: v41.27,68.45 v44.2,65.53 | ISP2.2 71.12,49.53 71.12,53.34 68.58,55.88 68.58,83.44 v66.04,85.98 | v27.94,63.5 27.94,52.07 v29.21,50.8
  Bottom 0.305: IC1.14 48.34,74.89 46.99,73.53 44.7,73.53 43.62,72.45 | 35.56,71.5 34.29,71.5 33.78,70.99 | 35.56,71.5 39.04,71.5 IC1.2 40.81,69.72 40.89,69.72 | IC1.24 51.77,67.82 50.8,67.82 46.61,63.63 46.1,63.63 | 40.89,69.72 40.51,69.34 | IC1.44 39.04,67.94 40.48,69.38 40.51,69.34 | IC1.34 46.1,63.56 46.1,63.63 | 40.89,69.72 43.62,72.45 | IC1.7 43.62,72.57 43.62,72.45 | C5.1 35.56,71.31 35.56,71.5 | 40.51,69.34 41.27,68.58 v41.27,68.45 | v44.2,65.53 46.1,63.63 | 27.94,68.71 28.07,68.71 30.48,71.12 31.56,71.12 C6.1 31.82,70.99 33.78,70.99 | 27.94,68.71 D48.2 | v27.94,63.5 27.94,68.71 | v66.04,85.98 65.98,86.04 R1.2 | v29.21,50.8 58.42,50.8 62.23,46.99 66.04,46.99 ISP2.2 | C4.1 33.78,70.99
XTAL1
  Bottom 0.152: IC1.17 50.67,73.79 50.67,75.56 50.16,76.07 C2.1 50.61,81.35 52.7,83.44 Q1.X1
XTAL2
  Bottom 0.152: C1.1 47.91,81.31 | 47.91,81.31 49.76,79.47 49.76,75.83 50.16,75.42 50.16,74.41 IC1.16 | Q1.X2 46.61,87.38 46.61,82.3 47.59,81.31 47.91,81.31
(copper drawn outside any net)
  shapes: Top area x2

### Text on the board
bPlace: Sand Ortholinear v1.1 | Luke LaCasse 2020